# Altium schematic sheet Clock.SchDoc
size Tabloid; DrawnBy: V-P.Rheaume@USherbrooke.ca; DocumentNumber: 4; SheetNumber: 4; SheetTotal: 11; SheetName: Clock; ProjectTitle: 16SoundsUSB
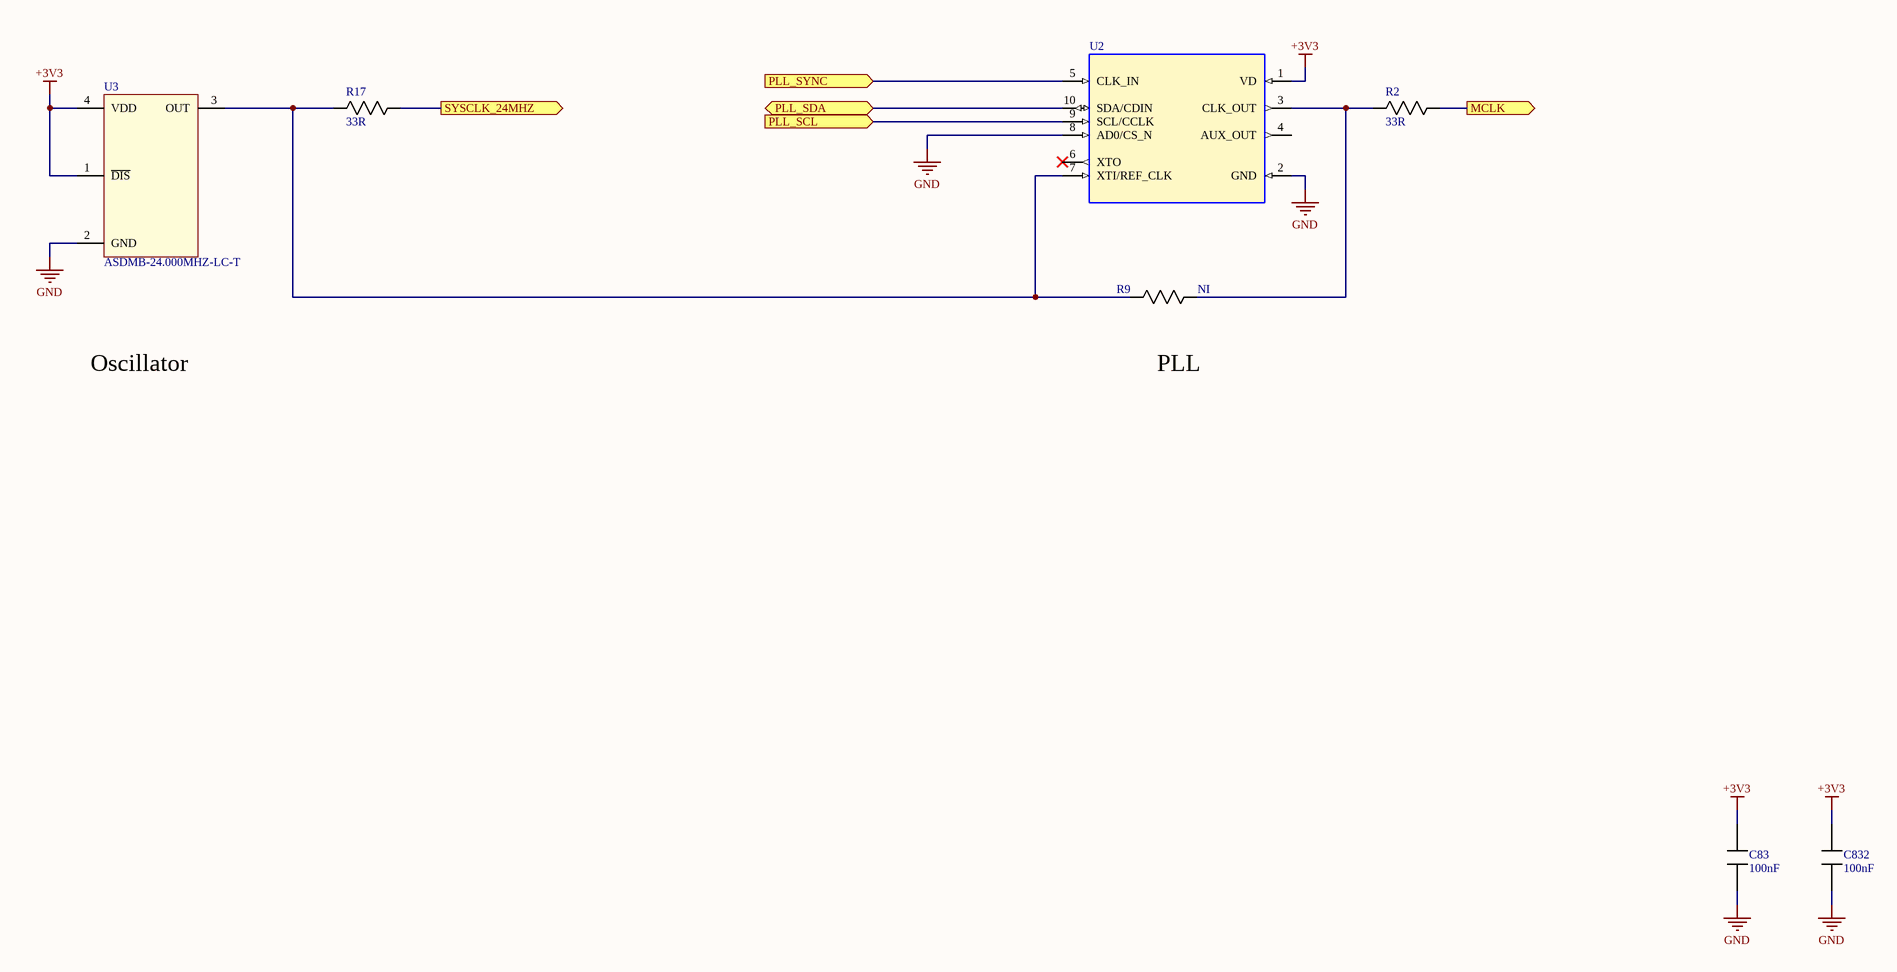
[diagram p0: Clock.SchDoc]

## Parts
C83  value 100nF  [0603]  (hidden comment: Capacitor)
C832  value 100nF  [0603]  (hidden comment: Capacitor)
R2  value 33R  [0603]  (hidden comment: Resistor)
R9  Resistor  [0603]  (value not drawn)
R17  value 33R  [0603]  (hidden comment: Resistor)
U2  CS2100_CP  [MSOP10]  (value not drawn)
U3  Mfg_PN: ASDMB-24.000MHZ-LC-T  [OSC_ADSMB]  (hidden comment: OSC_ASDMB)

## Ports
MCLK (out), PLL_SCL (in), PLL_SDA (bidir), PLL_SYNC (in), SYSCLK_24MHZ (out)

## Nets
+3V3: C83.1 C832.1 U2.1(VD) U3.1(~{DIS}) U3.4(VDD)
GND: C83.2 C832.2 U2.2(GND) U2.8(AD0/CS_N) U3.2(GND)
MCLK: R2.2 ; port MCLK
PLL_SCL: U2.9(SCL/CCLK) ; port PLL_SCL
PLL_SDA: U2.10(SDA/CDIN) ; port PLL_SDA
PLL_SYNC: U2.5(CLK_IN) ; port PLL_SYNC
SYSCLK_24MHZ: R17.2 ; port SYSCLK_24MHZ
NetR2_1: R2.1 R9.2 U2.3(CLK_OUT)
NetR9_1: R9.1 R17.1 U2.7(XTI/REF_CLK) U3.3(OUT)

Not connected (* = marked no-connect by the designer): U2 4(AUX_OUT) 6(XTO)*

## Notes on the sheet
- Oscillator
- PLL
- Sheet name
- http://creativecommons.org
- Project name
- Contact
- Rev
- Date
- Sheet
- of

## Library data of the parts
R9 = Resistor: Value: 0R; HelpURL: *; Mfg: *; Mfg_PN: *; NI: NI; Supplier1: *; Supplier1_PN: *; Type: *; Rating: *; Tolerance: *
U2 = CS2100_CP: Fractional-N Clock Multiplier, Crystal Reference, MSOP10; Mfg: Cirrus Logic; Mfg_PN: CS2100-CP-CZZ; Supplier1: Digikey; Supplier1_PN: 598-1750-ND
U3 = OSC_ASDMB: Oscillator; 1V8 to 3V3; Mfg: Abracon; HelpURL: http://www.abracon.com/Oscillators/ASDMB.pdf; Supplier1: Digikey; Supplier1_PN: 535-11728-1-ND; NI: *; Type: 24MHz
C83 C832 = Capacitor: HelpURL: *; Mfg: *; Mfg_PN: *; NI: *; Supplier1: *; Supplier1_PN: *; Tolerance: *; Type: *; Rating: *
R2 R17 = Resistor: HelpURL: *; Mfg: *; Mfg_PN: *; NI: *; Supplier1: *; Supplier1_PN: *; Type: *; Rating: *; Tolerance: *